# Altium schematic sheet RELAY14.SchDoc
size A
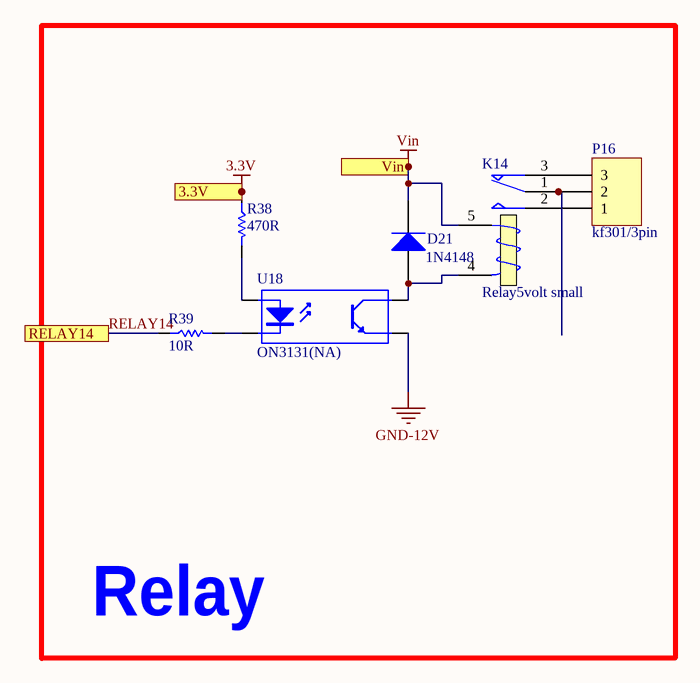
[diagram p0: RELAY14.SchDoc]

## Parts
D21  1N4148  [sod123]
K14  Relay5volt small  [relay5_childern]
P16  kf301/3pin  [Blue Connector 1*3 -kf301]
R38  470R  [0805/resistor]
R39  10R  [0805/resistor]
U18  ON3131(NA)  [OPTO_COUPLER]

## Blocks framed on the sheet
Relay: D21 K14 P16 R38 R39 U18

## Ports
3.3V, RELAY14, Vin

## Nets
3.3V: R38.1 ; port 3.3V
GND-12V: U18.3(E)
Vin: D21.K K14.5 ; port Vin
RELAY14: R39.1 ; port RELAY14
NetD21_A: D21.A K14.4(T2) U18.4(C)
NetK14_1: K14.1(COM) P16.2
NetK14_2: K14.2(NO) P16.1
NetK14_3: K14.3(T1) P16.3
NetR38_2: R38.2 U18.1(A)
NetR39_2: R39.2 U18.2(K)

## Library data of the parts
D21 = Diode 1N4007: 1 Amp General Purpose Rectifier; Published: 8-Jun-2000; LatestRevisionDate: 17-Jul-2002; LatestRevisionNote: Re-released for DXP Platform.; DatasheetVersion: 1998; PackageVersion: Aug-1999; PackageReference: DO-41; Publisher: Altium Limited; PackageDescription: Diode, Axial; Body 5.2 x 2.7 mm (LxDia. max), Lead Dia. 0.86 mm (max); Code_JEDEC: DO-204-AL; ComponentLink1Description: Manufacturer Link; ComponentLink1URL: http://www.fairchildsemi.com/; ComponentLink2Description: Datasheet; ComponentLink2URL: http://www.fairchildsemi.com/ds/1N%2F1N4001.pdf
K14 = Relay: SPDT Relay; Published: 8-Jun-2000; LatestRevisionDate: 17-Jul-2002; LatestRevisionNote: Re-released for DXP Platform.; PackageReference: MODULE5B; Publisher: Altium Limited
P16 = Header 3: LatestRevisionDate: 17-Jul-2002; LatestRevisionNote: Re-released for DXP Platform.; Publisher: Altium Limited
R38 R39 = Resistor: Tolerance: 5%; Power: 1/8 W
  R38: Value: 470R
  R39: Value: 10R
U18 = Optoisolator1: 4-Pin Phototransistor Optocoupler; Published: 24-Mar-1999; LatestRevisionDate: 04-Mar-2005; LatestRevisionNote: Sch pins 3 & 4 Swapped.; DatasheetVersion: Nov-2003; PackageReference: DIP-4; Publisher: Altium Limited